# EAGLE design irc_base (1) (EAGLE 9.5.2)
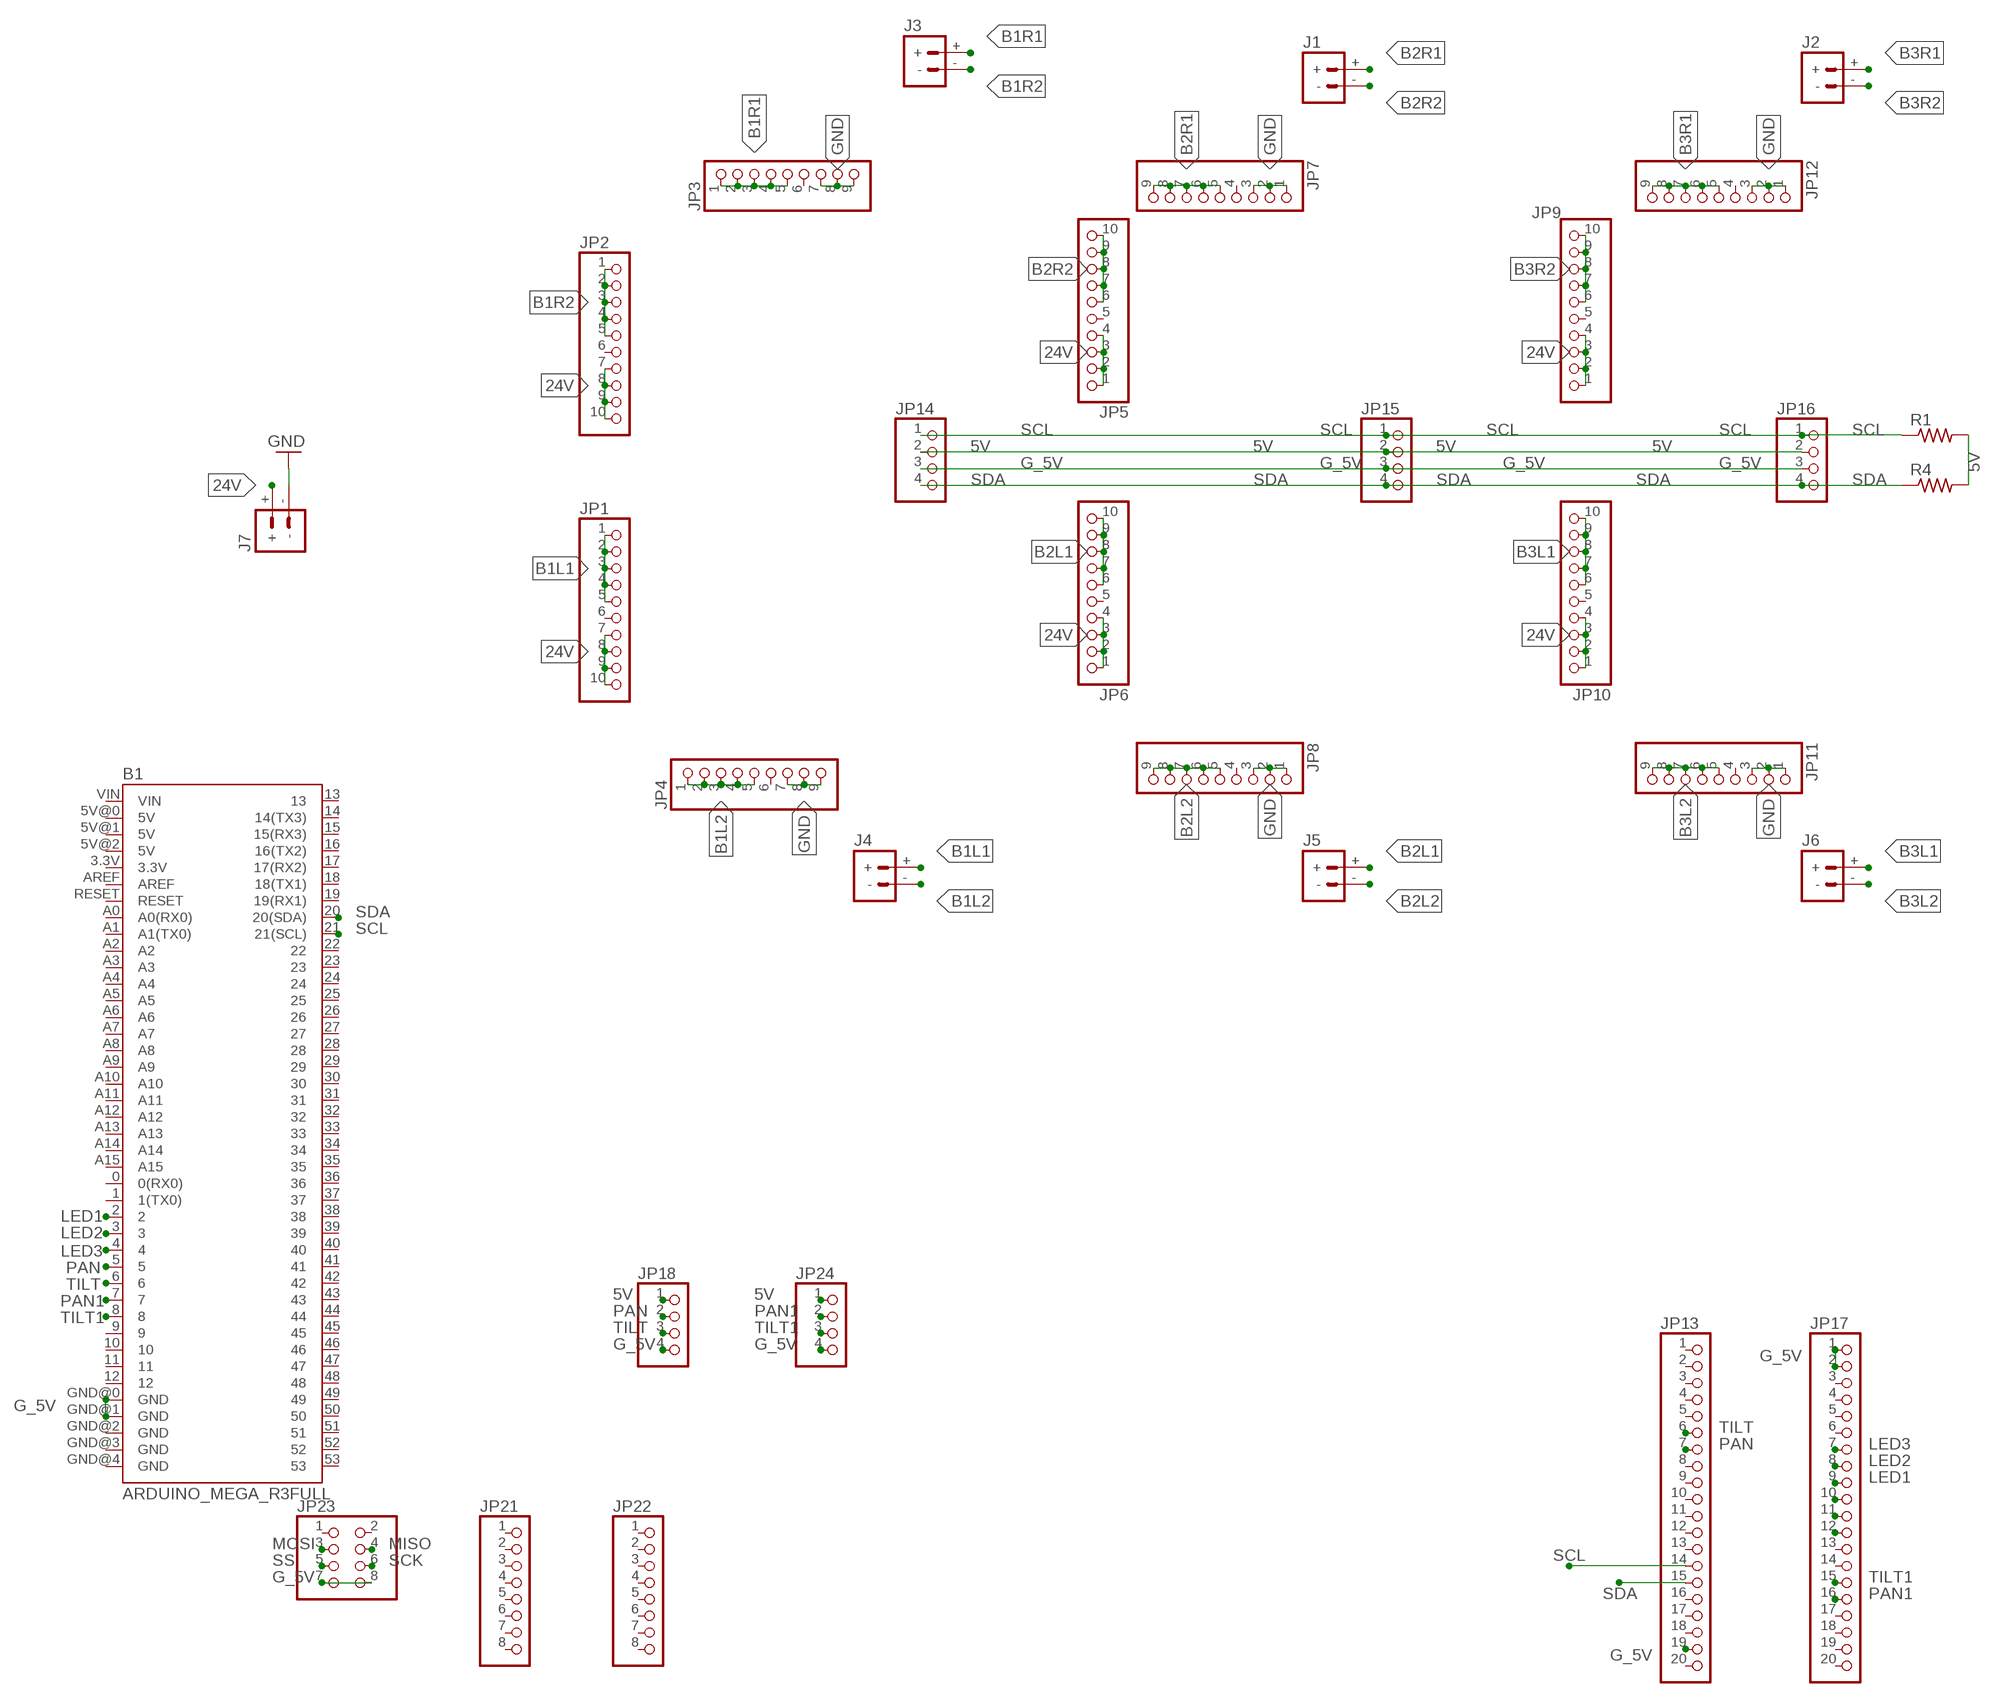
[diagram p0: schematic, sheet 1, part 1 of 2]
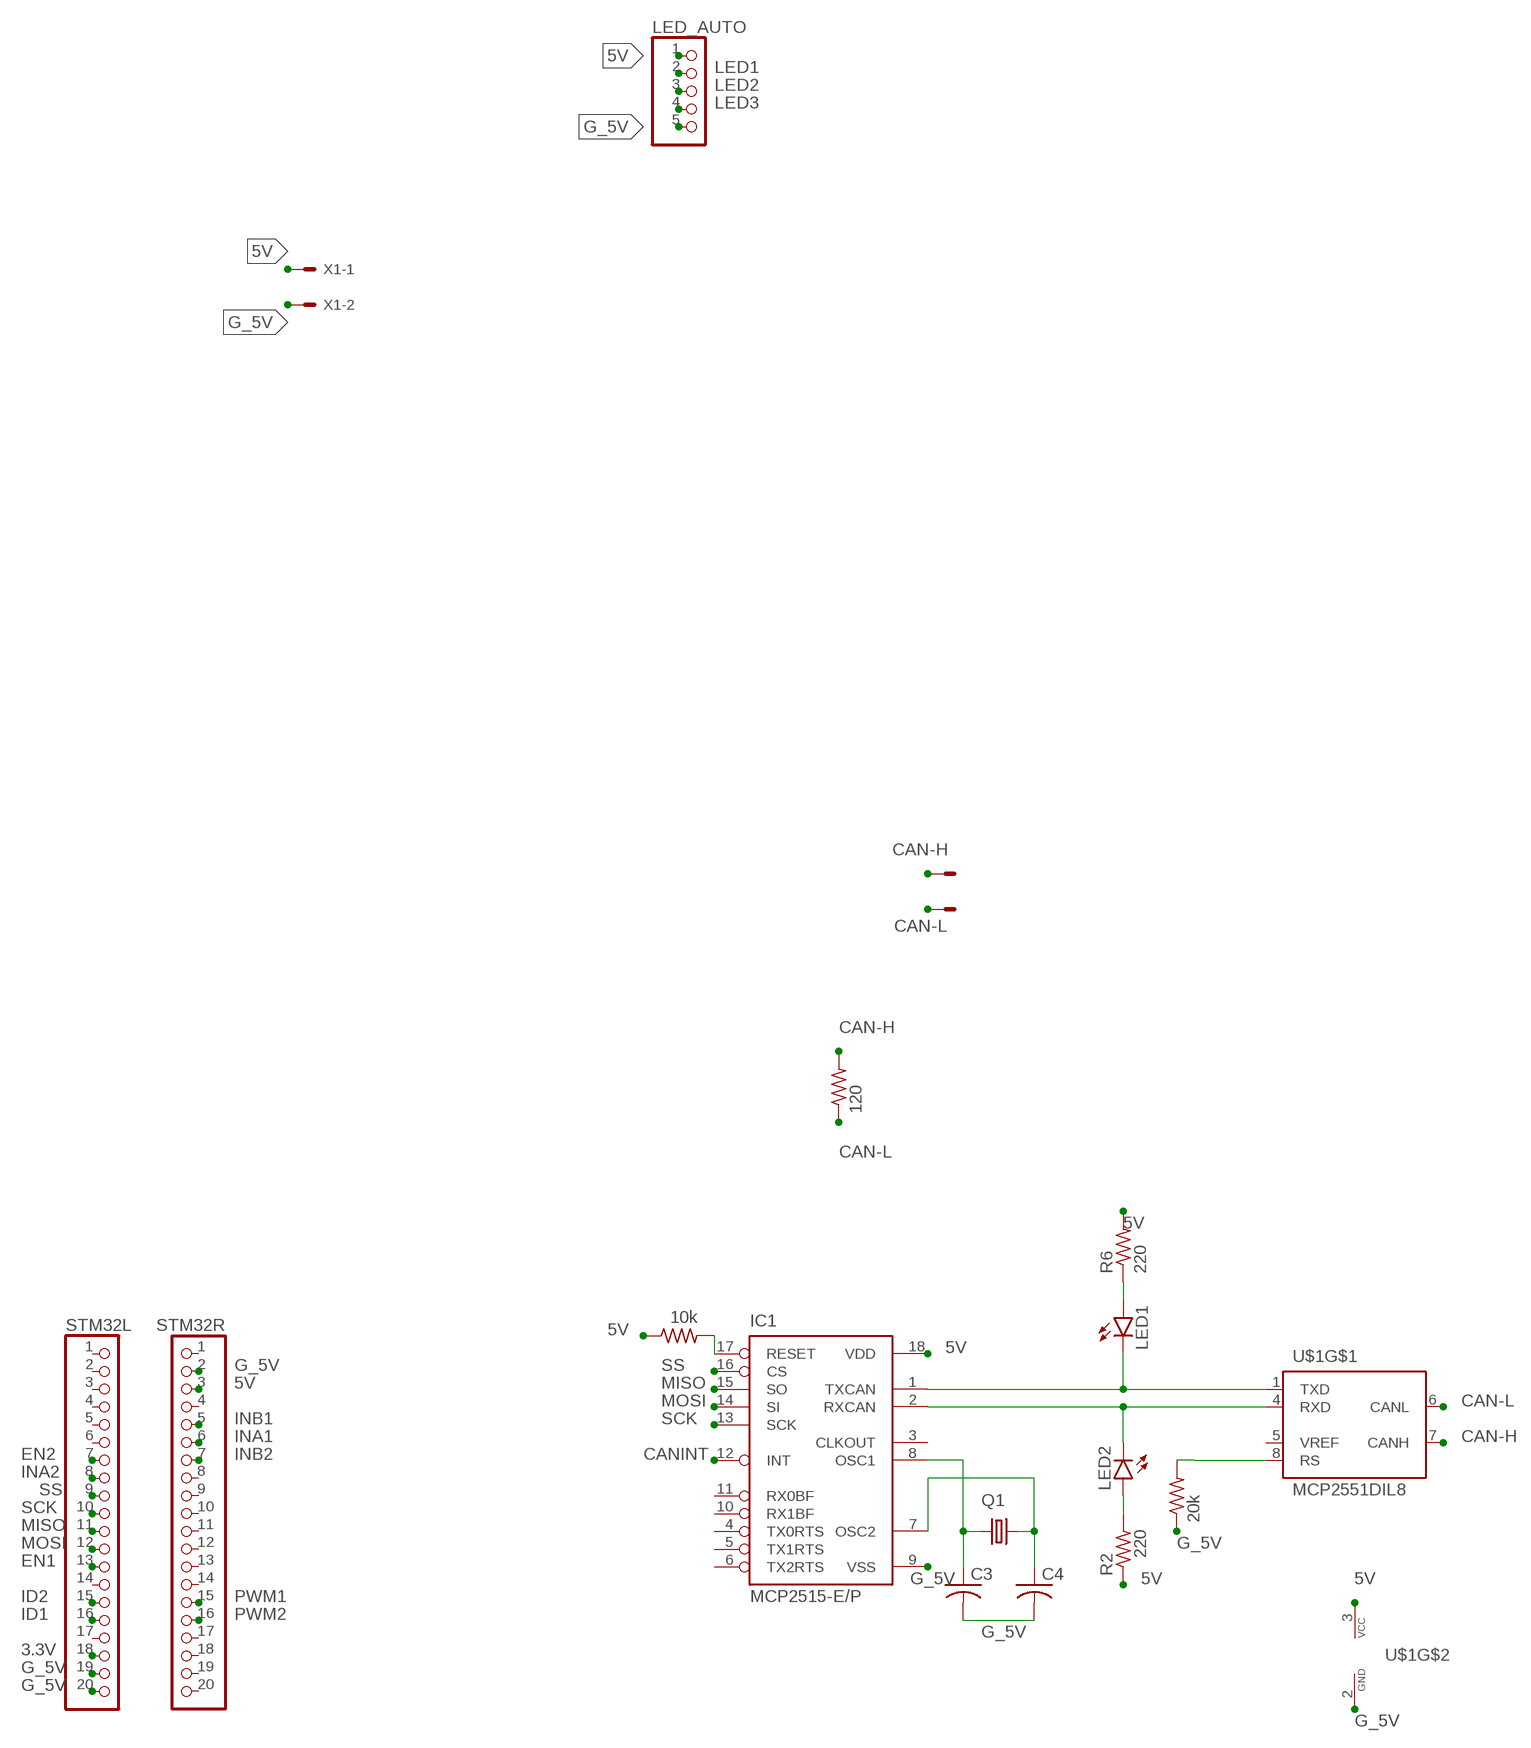
[diagram p1: schematic, sheet 1, part 2 of 2]

## Parts
B1  ARDUINO_MEGA_R3FULL  [ARDUINO_MEGA]
C3  C-US025-024X044  [C025-024X044]
C4  C-US025-024X044  [C025-024X044]
IC1  MCP2515-E/P  [DIL18]
J1  BATTERY_CONN_DEANS  [DEANS]
J2  BATTERY_CONN_DEANS  [DEANS]
J3  BATTERY_CONN_DEANS  [DEANS]
J4  BATTERY_CONN_DEANS  [DEANS]
J5  BATTERY_CONN_DEANS  [DEANS]
J6  BATTERY_CONN_DEANS  [DEANS]
J7  BATTERY_CONN_DEANS  [DEANS]
JP1  PINHD-1X10  [1X10]
JP2  PINHD-1X10  [1X10]
JP3  PINHD-1X9  [1X09]
JP4  PINHD-1X9  [1X09]
JP5  PINHD-1X10  [1X10]
JP6  PINHD-1X10  [1X10]
JP7  PINHD-1X9  [1X09]
JP8  PINHD-1X9  [1X09]
JP9  PINHD-1X10  [1X10]
JP10  PINHD-1X10  [1X10]
JP11  PINHD-1X9  [1X09]
JP12  PINHD-1X9  [1X09]
JP13  PINHD-1X20  [1X20]
JP14  PINHD-1X4  [1X04]
JP15  PINHD-1X4  [1X04]
JP16  PINHD-1X4  [1X04]
JP17  PINHD-1X20  [1X20]
JP18  PINHD-1X4  [1X04]
JP21  PINHD-1X8  [1X08]
JP22  PINHD-1X8  [1X08]
JP23  PINHD-2X4  [2X04]
JP24  PINHD-1X4  [1X04]
LED1  LEDSMT1206  [1206]
LED2  LEDSMT1206  [1206]
LED_AUTO  PINHD-1X5  [1X05]
Q1  CRYSTALHC49U-V  [HC49U-V]
R1  R-US_0207/9  [0207/9]
R2  220  R-US_R0805  [R0805]
R3  120  R-US_0207/9  [0207/9]
R4  R-US_0207/9  [0207/9]
R6  220  R-US_R0805  [R0805]
R39  10k  R-US_0207/10  [0207/10]
R40  20k  R-US_0207/10  [0207/10]
STM32L  PINHD-1X20  [1X20]
STM32R  PINHD-1X20  [1X20]
U$1  MCP2551DIL8  [DIL08]
X1  KK-156-2  [KK-156-2]
X2  KK-156-2  [KK-156-2]

## Nets
3.3V: STM32L.18
5V: IC1.18(VDD) JP14.2 JP15.2 JP16.2 JP18.1 JP24.1 LED_AUTO.1 R1.2 R2.1 R4.2 R6.2 R39.1 STM32R.3 U$1.3(VCC) X1.1
24V: J7.+ JP1.7 JP1.8 JP1.9 JP1.10 JP2.7 JP2.8 JP2.9 JP2.10 JP5.1 JP5.2 JP5.3 JP5.4 JP6.1 JP6.2 JP6.3 JP6.4 JP9.1 JP9.2 JP9.3 JP9.4 JP10.1 JP10.2 JP10.3 JP10.4
B1L1: J4.+ JP1.1 JP1.2 JP1.3 JP1.4 JP1.5
B1L2: J4.- JP4.1 JP4.2 JP4.3 JP4.4 JP4.5
B1R1: J3.+ JP3.1 JP3.2 JP3.3 JP3.4 JP3.5
B1R2: J3.- JP2.1 JP2.2 JP2.3 JP2.4 JP2.5
B2L1: J5.+ JP6.6 JP6.7 JP6.8 JP6.9 JP6.10
B2L2: J5.- JP8.5 JP8.6 JP8.7 JP8.8 JP8.9
B2R1: J1.+ JP7.5 JP7.6 JP7.7 JP7.8 JP7.9
B2R2: J1.- JP5.6 JP5.7 JP5.8 JP5.9 JP5.10
B3L1: J6.+ JP10.6 JP10.7 JP10.8 JP10.9 JP10.10
B3L2: J6.- JP11.5 JP11.6 JP11.7 JP11.8 JP11.9
B3R1: J2.+ JP12.5 JP12.6 JP12.7 JP12.8 JP12.9
B3R2: J2.- JP9.6 JP9.7 JP9.8 JP9.9 JP9.10
CAN-H: R3.2 U$1.7(CANH) X2.1
CAN-L: R3.1 U$1.6(CANL) X2.2
CANINT: IC1.12(INT)
EN1: STM32L.13
EN2: STM32L.7
G_5V: B1.GND@0(GND) B1.GND@1(GND) C3.2 C4.2 IC1.9(VSS) JP13.19 JP14.3 JP15.3 JP16.3 JP17.1 JP17.2 JP18.4 JP23.7 JP23.8 JP24.4 LED_AUTO.5 R40.1 STM32L.19 STM32L.20 STM32R.2 U$1.2(GND) X1.2
GND: J7.- JP3.7 JP3.8 JP3.9 JP4.7 JP4.8 JP4.9 JP7.1 JP7.2 JP7.3 JP8.1 JP8.2 JP8.3 JP11.1 JP11.2 JP11.3 JP12.1 JP12.2 JP12.3
ID1: STM32L.16
ID2: STM32L.15
INA1: STM32R.6
INA2: STM32L.8
INB1: STM32R.5
INB2: STM32R.7
LED1: B1.2 JP17.9 LED_AUTO.2
LED2: B1.3 JP17.8 LED_AUTO.3
LED3: B1.4 JP17.7 LED_AUTO.4
MISO: IC1.15(SO) JP23.4 STM32L.11
MOSI: IC1.14(SI) JP23.3 STM32L.12
N$1: IC1.1(TXCAN) LED1.C U$1.1(TXD)
N$2: R40.2 U$1.8(RS)
N$3: C4.1 IC1.7(OSC2) Q1.2
N$4: C3.1 IC1.8(OSC1) Q1.1
N$8: JP17.10
N$9: IC1.17(RESET) R39.2
N$10: JP17.11
N$11: JP17.12
N$29: LED2.A R2.2
N$37: LED1.A R6.1
N$38: IC1.2(RXCAN) LED2.C U$1.4(RXD)
PAN: B1.5 JP13.7 JP18.2
PAN1: B1.7 JP17.16 JP24.2
PWM1: STM32R.15
PWM2: STM32R.16
SCK: IC1.13(SCK) JP23.6 STM32L.10
SCL: B1.21(21(SCL)) JP13.14 JP14.1 JP15.1 JP16.1 R1.1
SDA: B1.20(20(SDA)) JP13.15 JP14.4 JP15.4 JP16.4 R4.1
SS: IC1.16(CS) JP23.5 STM32L.9
TILT: B1.6 JP13.6 JP18.3
TILT1: B1.8 JP17.15 JP24.3
Unconnected: B1.0(0(RX0)) B1.1(1(TX0)) B1.3.3V B1.5V@0(5V) B1.5V@1(5V) B1.5V@2(5V) B1.9 B1.10 B1.11 B1.12 B1.13 B1.14(14(TX3)) B1.15(15(RX3)) B1.16(16(TX2)) B1.17(17(RX2)) B1.18(18(TX1)) B1.19(19(RX1)) B1.22 B1.23 B1.24 B1.25 B1.26 B1.27 B1.28 B1.29 B1.30 B1.31 B1.32 B1.33 B1.34 B1.35 B1.36 B1.37 B1.38 B1.39 B1.40 B1.41 B1.42 B1.43 B1.44 B1.45 B1.46 B1.47 B1.48 B1.49 B1.50 B1.51 B1.52 B1.53 B1.A0(A0(RX0)) B1.A1(A1(TX0)) B1.A2 B1.A3 B1.A4 B1.A5 B1.A6 B1.A7 B1.A8 B1.A9 B1.A10 B1.A11 B1.A12 B1.A13 B1.A14 B1.A15 B1.AREF B1.GND@2(GND) B1.GND@3(GND) B1.GND@4(GND) B1.RESET B1.VIN IC1.3(CLKOUT) IC1.4(TX0RTS) IC1.5(TX1RTS) IC1.6(TX2RTS) IC1.10(RX1BF) IC1.11(RX0BF) JP1.6 JP2.6 JP3.6 JP4.6 JP5.5 JP6.5 JP7.4 JP8.4 JP9.5 JP10.5 JP11.4 JP12.4 JP13.1 JP13.2 JP13.3 JP13.4 JP13.5 JP13.8 JP13.9 JP13.10 JP13.11 JP13.12 JP13.13 JP13.16 JP13.17 JP13.18 JP13.20 JP17.3 JP17.4 JP17.5 JP17.6 JP17.13 JP17.14 JP17.17 JP17.18 JP17.19 JP17.20 JP21.1 JP21.2 JP21.3 JP21.4 JP21.5 JP21.6 JP21.7 JP21.8 JP22.1 JP22.2 JP22.3 JP22.4 JP22.5 JP22.6 JP22.7 JP22.8 JP23.1 JP23.2 STM32L.1 STM32L.2 STM32L.3 STM32L.4 STM32L.5 STM32L.6 STM32L.14 STM32L.17 STM32R.1 STM32R.4 STM32R.8 STM32R.9 STM32R.10 STM32R.11 STM32R.12 STM32R.13 STM32R.14 STM32R.17 STM32R.18 STM32R.19 STM32R.20 U$1.5(VREF)

## Library data of the parts
B1 = SparkFun-Boards:ARDUINO_MEGA_R3: Arduino Mega R3 ATmega2560 R3 compatible footprint. SparkFun Products: Arduino Mega 2560 R3 <https://www.sparkfun.com/products/11061>
C3 C4 = adafruit:C-US: CAPACITOR, American symbol
IC1 = mcp2515:MCP2515
J1-J7 = SparkFun-Connectors:BATTERY_CONN: Battery Connectors Various footprints for battery connections SparkFun Products: Deans Connector -M/F Pair <https://www.sparkfun.com/products/11864>; SF_ID: PRT-11864
JP1 JP2 JP5 JP6 JP9 JP10 = pinhead:PINHD-1X10: PIN HEADER
JP3 JP4 JP7 JP8 JP11 JP12 = pinhead:PINHD-1X9: PIN HEADER
JP13 JP17 = pinhead:PINHD-1X20: PIN HEADER
JP14-JP16 JP18 JP24 = pinhead:PINHD-1X4: PIN HEADER
JP21 JP22 = pinhead:PINHD-1X8: PIN HEADER
JP23 = adafruit:PINHD-2X4: PIN HEADER
LED1 LED2 = led:LED: LED OSRAM: - CHIPLED LG R971, LG N971, LY N971, LG Q971, LY Q971, LO R971, LY R971 LH N974, LH R974 LS Q976, LO Q976, LY Q976 LO Q996 - Hyper CHIPLED LW Q18S LB Q993, LB Q99A, LB R99A - SideLED LS A670, LO A670, LY A670, LG A670, LP A670 LB A673, LV A673, LT A673, LW A673 LH A674 LY A675 LS A676, LA A676, LO A676, LY A676, LW A676 LS A679, LY A679, LG A679 - Hyper Micro SIDELED® LS Y876, LA Y876, LO Y876, LY Y876 LT Y87S - SmartLED LW L88C, LW L88S LB L89C, LB L89S, LG L890 LS L89K, LO L89K, LY L89K LS L896, LA L896, LO L896, LY L896 - TOPLED LS T670, LO T670, LY T670, LG T670, LP T670 LSG T670, LSP T670, LSY T670, LOP T670, LYG T670 LG T671, LOG T671, LSG T671 LB T673, LV T673, LT T673, LW T673 LH T674 LS T676, LA T676, LO T676, LY T676, LB T676, LH T676, LSB T676, LW T676 LB T67C, LV T67C, LT T67C, LS T67K, LO T67K, LY T67K, LW E67C LS E67B, LA E67B, LO E67B, LY E67B, LB E67C, LV E67C, LT E67C LW T67C LS T679, LY T679, LG T679 LS T770, LO T770, LY T770, LG T770, LP T770 LB T773, LV T773, LT T773, LW T773 LH T774 LS E675, LA E675, LY E675, LS T675 LS T776, LA T776, LO T776, LY T776, LB T776 LHGB T686 LT T68C, LB T68C - Hyper Mini TOPLED® LB M676 - Mini TOPLED Santana® LG M470 LS M47K, LO M47K, LY M47K Source: http://www.osram.convergy.de LUXEON: - LUMILED® LXK2-PW12-R00, LXK2-PW12-S00, LXK2-PW14-U00, LXK2-PW14-V00 LXK2-PM12-R00, LXK2-PM12-S00, LXK2-PM14-U00 LXK2-PE12-Q00, LXK2-PE12-R00, LXK2-PE12-S00, LXK2-PE14-T00, LXK2-PE14-U00 LXK2-PB12-K00, LXK2-PB12-L00, LXK2-PB12-M00, LXK2-PB14-N00, LXK2-PB14-P00, LXK2-PB14-Q00 LXK2-PR12-L00, LXK2-PR12-M00, LXK2-PR14-Q00, LXK2-PR14-R00 LXK2-PD12-Q00, LXK2-PD12-R00, LXK2-PD12-S00 LXK2-PH12-R00, LXK2-PH12-S00 LXK2-PL12-P00, LXK2-PL12-Q00, LXK2-PL12-R00 Source: www.luxeon.com KINGBRIGHT: KA-3528ASYC Source: www.kingbright.com
LED_AUTO = pinhead:PINHD-1X5: PIN HEADER
Q1 = adafruit:CRYSTAL: CRYSTAL; OC_FARNELL: 1666969; OC_NEWARK: unknown
R1 R3 R4 R39 R40 = adafruit:R-US_: RESISTOR, American symbol
R2 R6 = rcl:R-US_: RESISTOR, American symbol; SPICEPREFIX: R
STM32L STM32R = adafruit:PINHD-1X20: PIN HEADER
U$1 = can:MCP2551: CAN Tranceiver Microchip
X1 X2 = con-molex:KK-156-2: KK 156 HEADER Source: http://www.molex.com/pdm_docs/sd/026604100_sd.pdf; MF: MOLEX; OC_FARNELL: unknown; OC_NEWARK: unknown

## Board
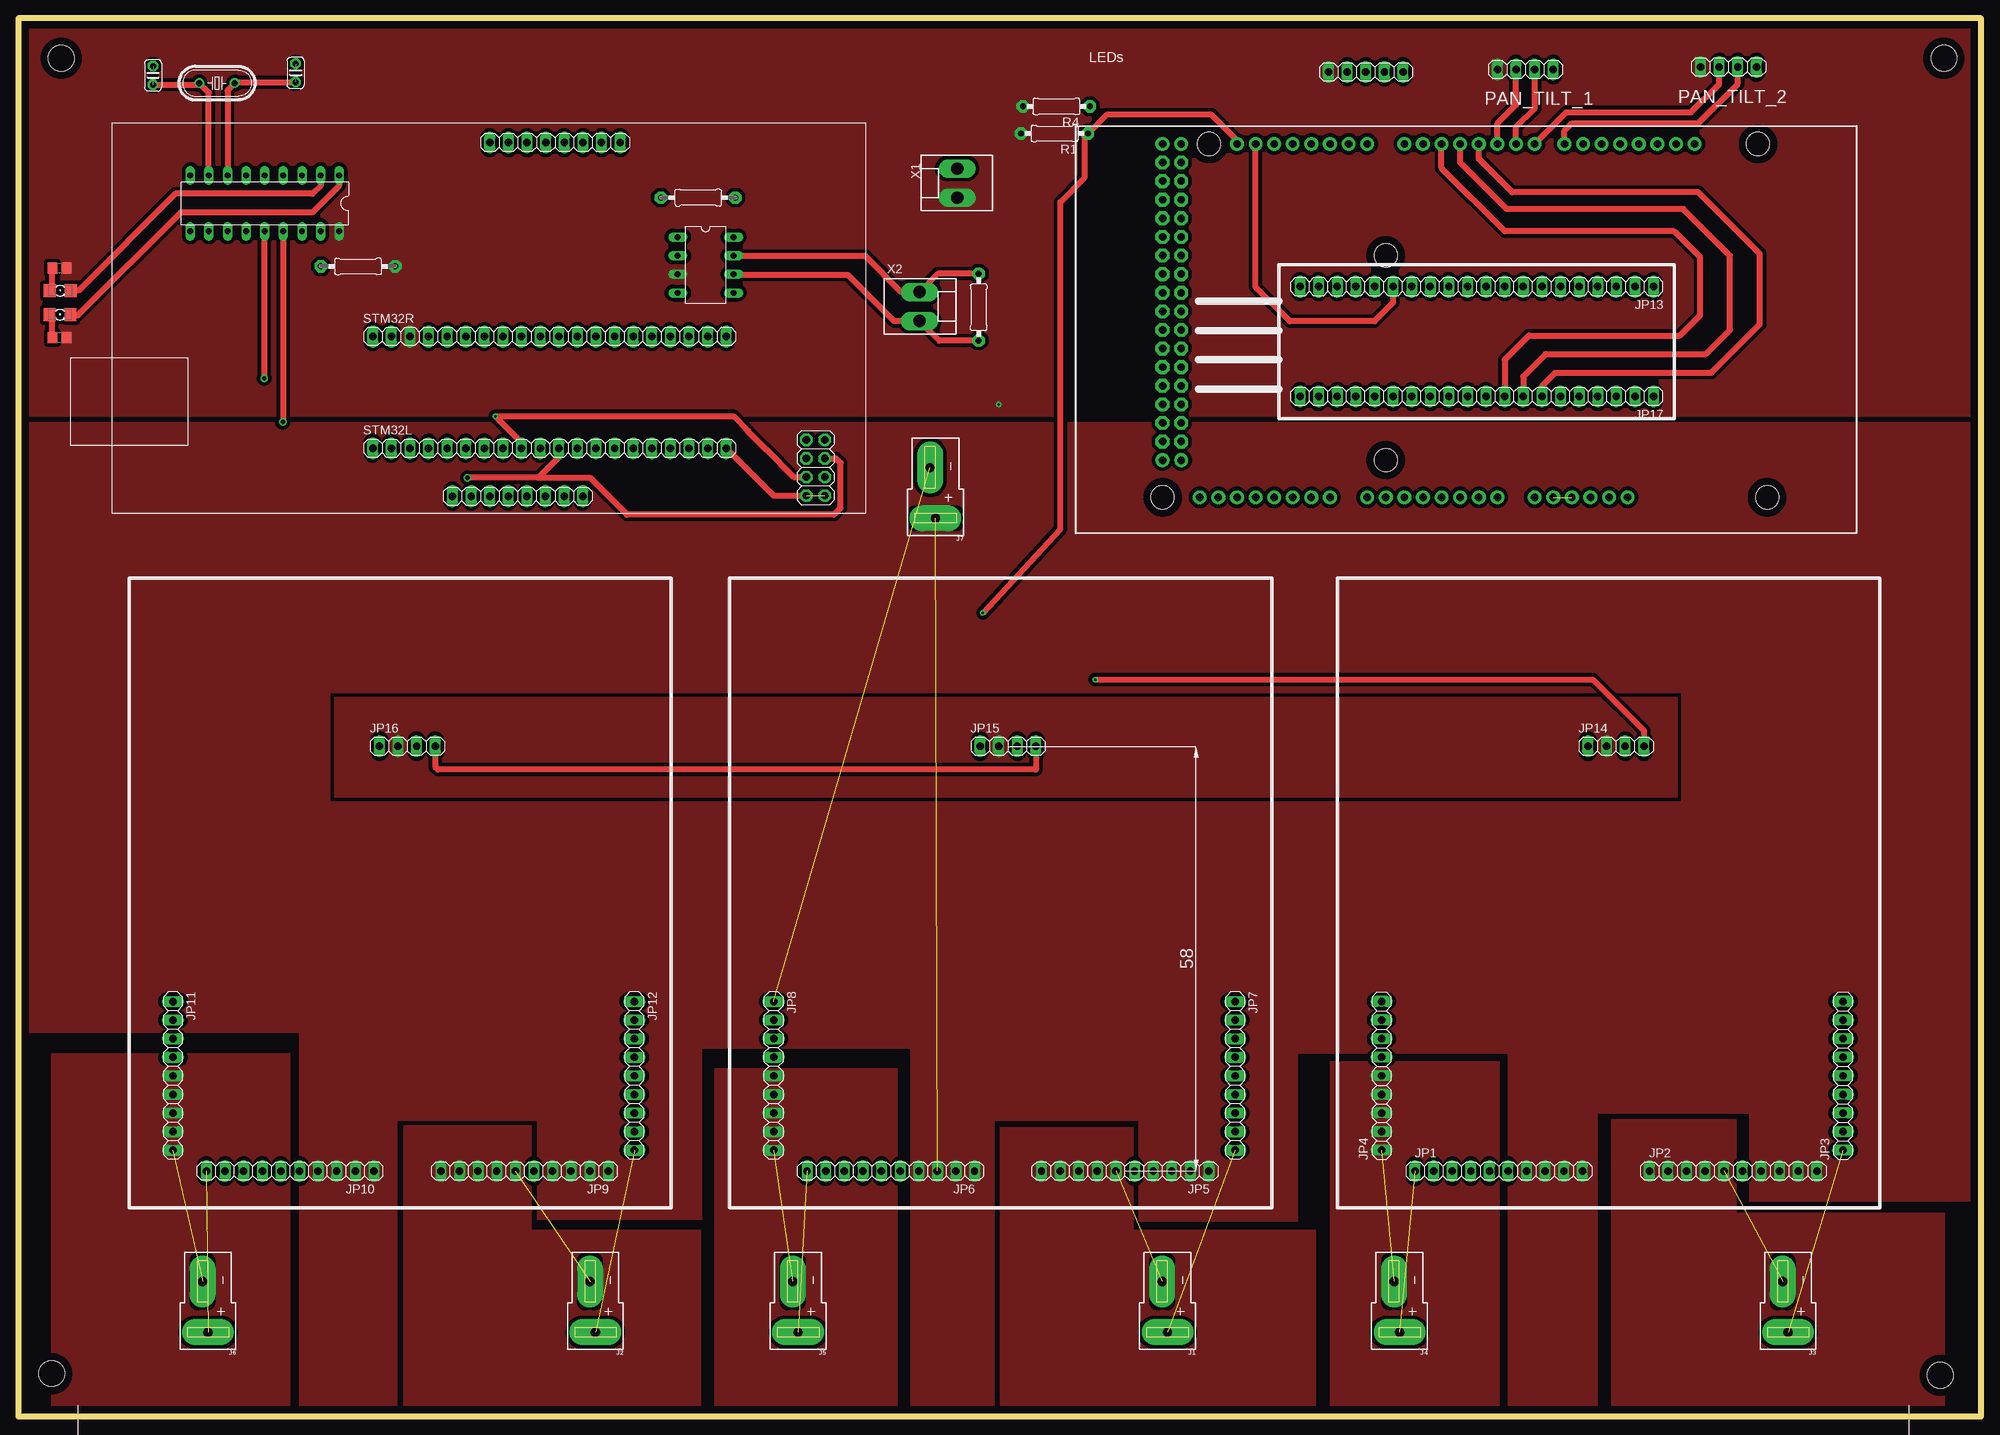
[diagram p2: board, top side]
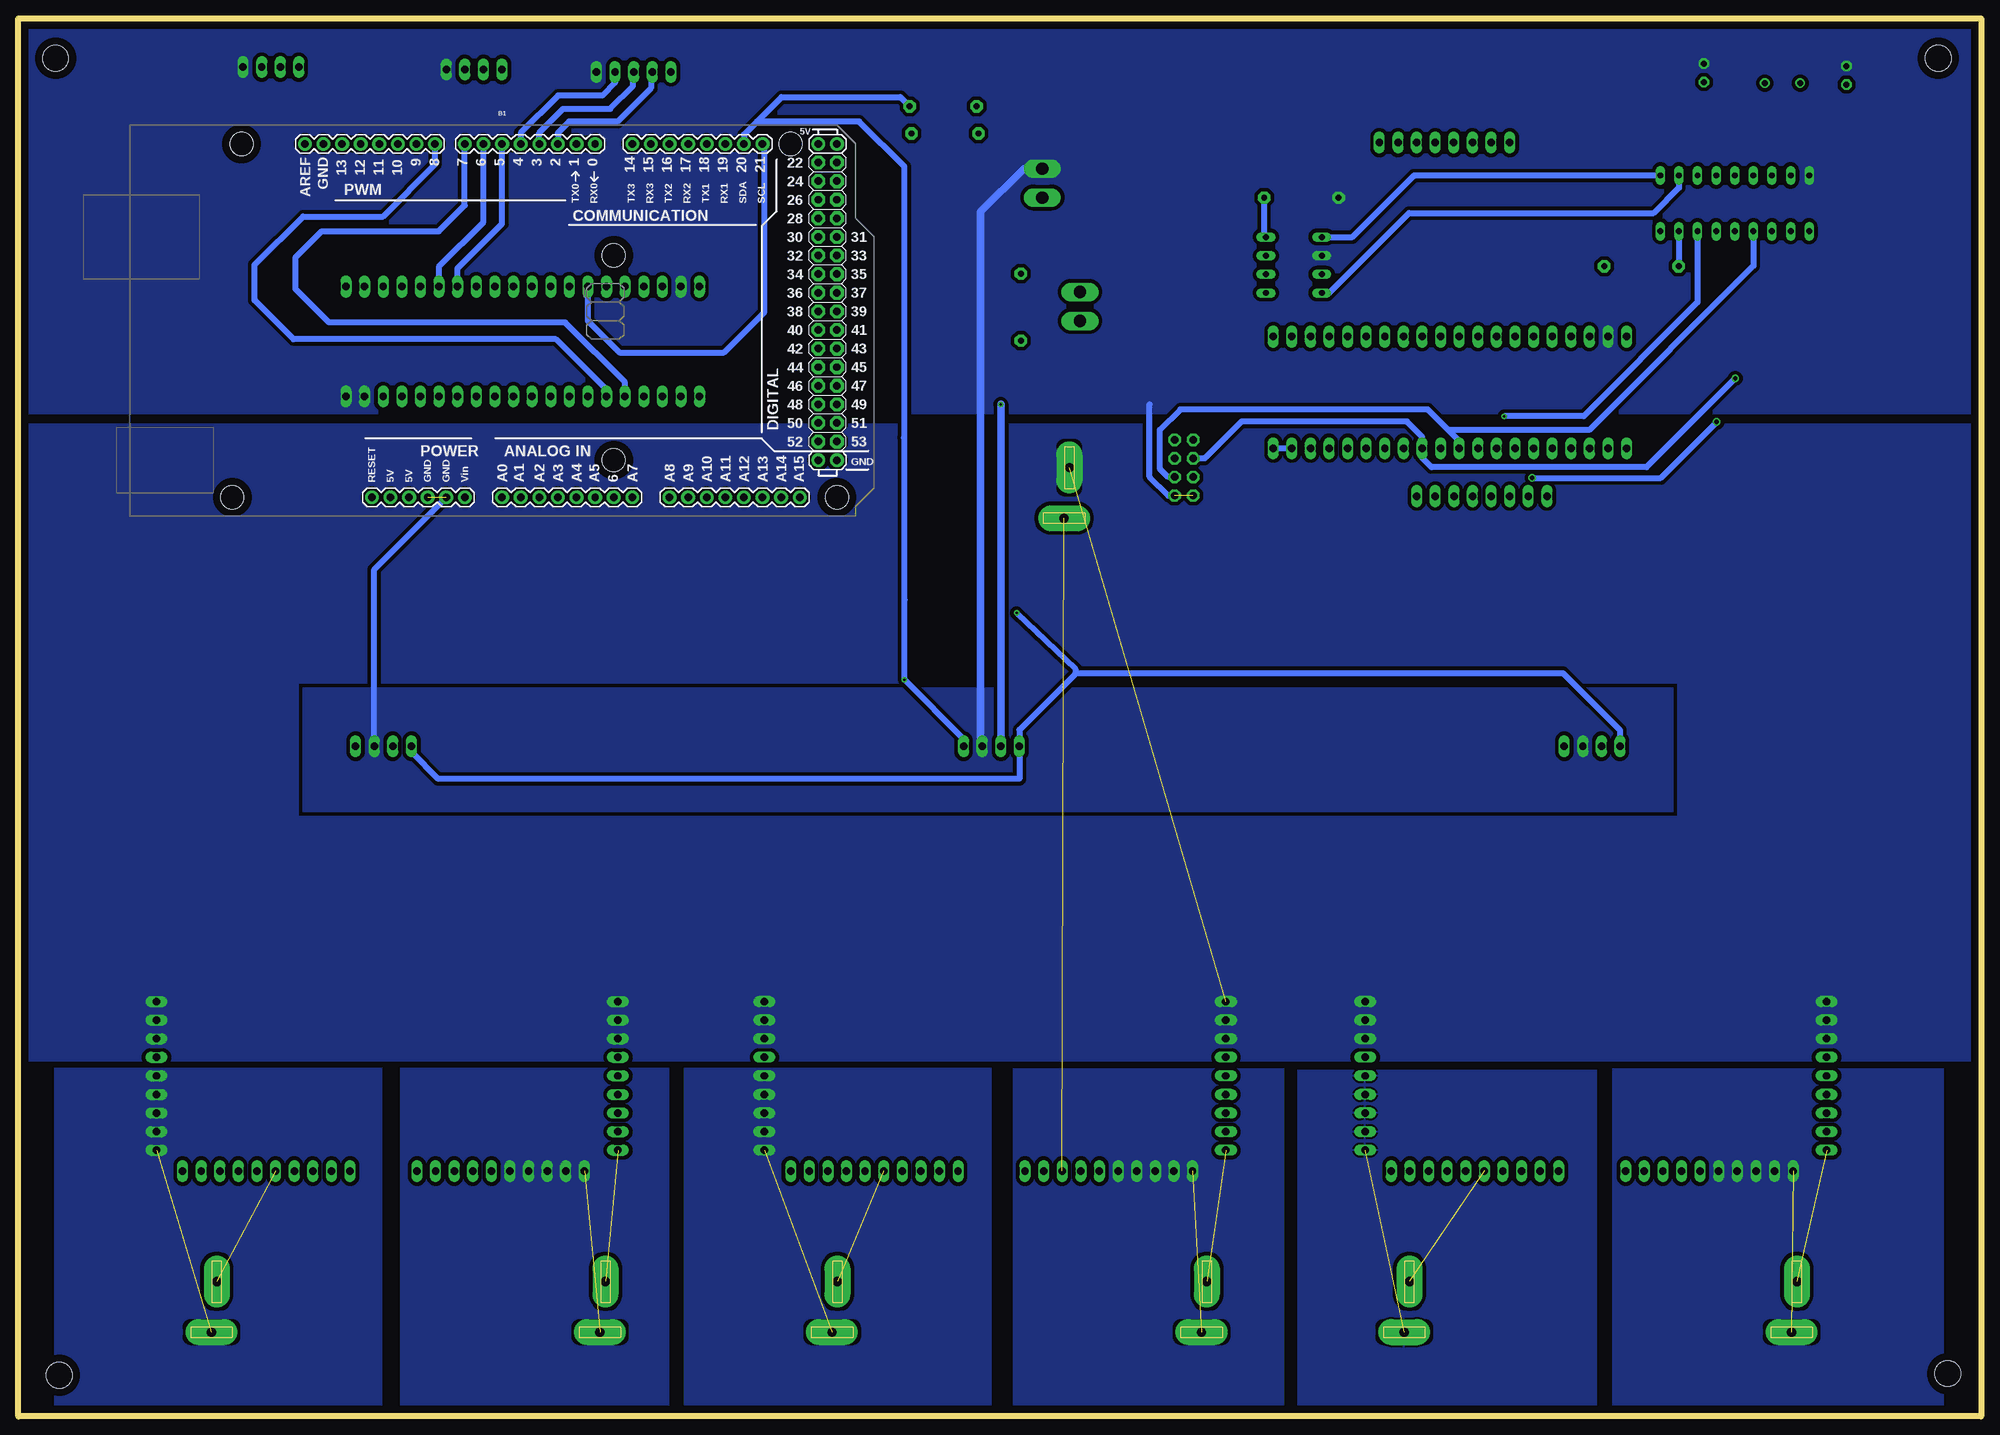
[diagram p3: board, bottom side, seen from below]

Size 267.97 x 190.88 mm. Coordinates in mm from the lower left corner, seen from the top.
Outline: 0,0 267.97,0 267.97,190.88 0,190.88 0,0
Copper layers (1*16): Top 0.035mm / dielectric 1.5mm / Bottom 0.035mm
Design rules "default *": minimum track width 6mil, minimum drill 0.35mm, track to track 20mil, track to pad 20mil, pad to pad 20mil, via to via 20mil, smd to smd 20mil, copper to edge 40mil, drill to drill 6mil, minimum pad ring 10mil, minimum via ring 8mil, stop-mask expansion 4mil, vias tented up to drill 0mil, thermal gap 10mil
Holes 3.56 mm at 5.84,185.42 262.89,185.42 262.38,5.59 4.57,5.84

### Footprints (pad centres in the part's own frame; a part is rotated, then mirrored left to right if it is on the bottom)
ARDUINO_MEGA = drill 1.016 pad 1.88: 0 13.97,24.13; 1 11.43,24.13; 2 8.89,24.13; 3 6.35,24.13; 3.3V -13.97,-24.13; 4 3.81,24.13; 5 1.27,24.13; 5V@0 -11.43,-24.13; 5V@1 44.45,24.13; 5V@2 46.99,24.13; 6 -1.27,24.13; 7 -3.81,24.13; 8 -7.874,24.13; 9 -10.414,24.13; 10 -12.954,24.13; 11 -15.494,24.13; 12 -18.034,24.13; 13 -20.574,24.13; 14 19.05,24.13; 15 21.59,24.13; 16 24.13,24.13; 17 26.67,24.13; 18 29.21,24.13; 19 31.75,24.13; 20 34.29,24.13; 21 36.83,24.13; A0 1.27,-24.13; A1 3.81,-24.13; A2 6.35,-24.13; A3 8.89,-24.13; A4 11.43,-24.13; A5 13.97,-24.13; A6 16.51,-24.13; A7 19.05,-24.13; A8 24.13,-24.13; A9 26.67,-24.13; A10 29.21,-24.13; A11 31.75,-24.13; A12 34.29,-24.13; A13 36.83,-24.13; A14 39.37,-24.13; A15 41.91,-24.13; AREF -25.654,24.13; GND@0 -8.89,-24.13; GND@1 -6.35,-24.13; GND@2 44.45,-19.05; GND@3 46.99,-19.05; GND@4 -23.114,24.13; RESET -16.51,-24.13; VIN -3.81,-24.13 | drill 1.016 pad 1.88 octagon: 22 44.45,21.59; 23 46.99,21.59; 24 44.45,19.05; 25 46.99,19.05; 26 44.45,16.51; 27 46.99,16.51; 28 44.45,13.97; 29 46.99,13.97; 30 44.45,11.43; 31 46.99,11.43; 32 44.45,8.89; 33 46.99,8.89; 34 44.45,6.35; 35 46.99,6.35; 36 44.45,3.81; 37 46.99,3.81; 38 44.45,1.27; 39 46.99,1.27; 40 44.45,-1.27; 41 46.99,-1.27; 42 44.45,-3.81; 43 46.99,-3.81; 44 44.45,-6.35; 45 46.99,-6.35; 46 44.45,-8.89; 47 46.99,-8.89; 48 44.45,-11.43; 49 46.99,-11.43; 50 44.45,-13.97; 51 46.99,-13.97; 52 44.45,-16.51; 53 46.99,-16.51 | hole 3.2: -34.29,24.13; -35.56,-24.13; 16.51,8.89; 16.51,-19.05; 40.64,24.13; 46.99,-24.13
C025-024X044 = drill 0.813 pad 1.422 octagon: 1 -1.27,0; 2 1.27,0
DIL18 = drill 0.813 long: 1 -10.16,-3.81; 2 -7.62,-3.81; 3 -5.08,-3.81; 4 -2.54,-3.81; 5 0,-3.81; 6 2.54,-3.81; 7 5.08,-3.81; 8 7.62,-3.81; 9 10.16,-3.81; 10 10.16,3.81; 11 7.62,3.81; 12 5.08,3.81; 13 2.54,3.81; 14 0,3.81; 15 -2.54,3.81; 16 -5.08,3.81; 17 -7.62,3.81; 18 -10.16,3.81
DEANS = drill 1.27 pad 3.556 long: + 0,0; - 0.737,-6.921
1X10 = drill 1.016 long: 1 -11.43,0; 2 -8.89,0; 3 -6.35,0; 4 -3.81,0; 5 -1.27,0; 6 1.27,0; 7 3.81,0; 8 6.35,0; 9 8.89,0; 10 11.43,0
1X09 = drill 1.016 long: 1 -10.16,0; 2 -7.62,0; 3 -5.08,0; 4 -2.54,0; 5 0,0; 6 2.54,0; 7 5.08,0; 8 7.62,0; 9 10.16,0
1X20 = drill 1.016 long: 1 -24.13,0; 2 -21.59,0; 3 -19.05,0; 4 -16.51,0; 5 -13.97,0; 6 -11.43,0; 7 -8.89,0; 8 -6.35,0; 9 -3.81,0; 10 -1.27,0; 11 1.27,0; 12 3.81,0; 13 6.35,0; 14 8.89,0; 15 11.43,0; 16 13.97,0; 17 16.51,0; 18 19.05,0; 19 21.59,0; 20 24.13,0
1X04 = drill 1.016 long: 1 -3.81,0; 2 -1.27,0; 3 1.27,0; 4 3.81,0
1X08 = drill 1.016 long: 1 -8.89,0; 2 -6.35,0; 3 -3.81,0; 4 -1.27,0; 5 1.27,0; 6 3.81,0; 7 6.35,0; 8 8.89,0
2X04 = drill 1.016 pad 1.676 octagon: 1 -3.81,-1.27; 2 -3.81,1.27; 3 -1.27,-1.27; 4 -1.27,1.27; 5 1.27,-1.27; 6 1.27,1.27; 7 3.81,-1.27; 8 3.81,1.27
1206 = smd 1.6 x 1.803: A -1.422,0; C 1.422,0
1X05 = drill 1.016 long: 1 -5.08,0; 2 -2.54,0; 3 0,0; 4 2.54,0; 5 5.08,0
HC49U-V = drill 0.813: 1 -2.413,0; 2 2.413,0
0207/9 = drill 0.813 pad 1.676 octagon: 1 -4.572,0; 2 4.572,0
R0805 = smd 1.3 x 1.5: 1 -0.95,0; 2 0.95,0
0207/10 = drill 0.813 pad 1.676 octagon: 1 -5.08,0; 2 5.08,0
DIL08 = drill 0.813 long: 1 -3.81,-3.81; 2 -1.27,-3.81; 3 1.27,-3.81; 4 3.81,-3.81; 5 3.81,3.81; 6 1.27,3.81; 7 -1.27,3.81; 8 -3.81,3.81
KK-156-2 = drill 1.7 pad 2.184 long: 1 -1.98,0; 2 1.98,0

### Placement (x,y rotation side)
B1  203.2,149.61 0 bottom
C3  18.4,183.09 90 top
C4  37.86,183.43 90 top
IC1  33.64,165.61 180 top
J1  156.89,11.49 180 top
J2  78.78,11.49 180 top
J3  241.61,11.49 180 top
J4  188.56,11.49 180 top
J5  106.45,11.49 180 top
J6  25.89,11.49 180 top
J7  125.21,122.62 180 top
JP1  202.11,33.49 0 top
JP2  234.11,33.49 0 top
JP3  249.11,46.49 90 top
JP4  186.11,46.49 90 top
JP5  151.11,33.49 180 top
JP6  119.11,33.49 180 top
JP7  166.11,46.49 270 top
JP8  103.11,46.49 270 top
JP9  69.11,33.49 180 top
JP10  37.11,33.49 180 top
JP11  21.11,46.49 270 top
JP12  84.11,46.49 270 top
JP13  199.11,154.25 180 top
JP14  218.11,91.49 0 top
JP15  135.11,91.49 0 top
JP16  53.11,91.49 0 top
JP17  199.11,139.25 180 top
JP18  205.74,183.9 0 top
JP21  73.27,173.91 0 top
JP22  68.17,125.64 0 top
JP23  108.85,129.52 270 top
JP24  233.47,184.22 0 top
LED1  5.7,150.43 0 top
LED2  5.72,153.7 0 top
LED_AUTO  183.96,183.56 0 top
Q1  27.12,182.04 0 top
R1  141.46,175.16 180 top
R2  5.65,156.74 180 top
R3  131.1,151.44 90 top
R4  141.71,178.86 180 top
R6  5.6,147.3 0 top
R39  46.39,157.01 180 top
R40  92.81,166.39 0 top
STM32L  72.52,132.19 0 top
STM32R  72.52,147.43 0 top
U$1  93.84,157.2 270 top
X1  128.17,168.37 90 top
X2  123.03,151.54 270 top

### Tracks (layer width: path | path; a pad name or v marks a point on that pad's centre or on a via)
5V  (via drill 0.35)
  Top 0.813: 6.56,147.32 R6.2
  Bottom 1.016: v133.84,138.18 JP15.2
  pour Top (no thermals): 43.11,98.16 43.11,84.54 226.49,84.54 226.49,98.16
  pour Top (no thermals): -7.62,212.85 -7.62,136.91 278.35,136.91 278.35,212.85
24V  (1 unrouted)
  pour Top (rank 2, no thermals): -12.98,135.66 -12.98,52.42 38.31,52.42 38.31,-6.3 51.73,-6.3 51.73,40.42 70.84,40.42 70.84,26.89 93.36,26.89 93.36,50.29 121.77,50.29 121.77,-3.2 133.29,-3.2 133.29,40.42 152.89,40.42 152.89,26.7 174.69,26.7 174.69,49.64 203.32,49.64 203.32,-4.57 215.58,-4.57 215.58,41.41 236.33,41.41 236.33,29.43 316.03,29.43 316.03,135.66
B1L1  (1 unrouted)
  pour Bottom (no thermals): 215.86,47.49 215.86,-6.51 179.11,-6.51 179.11,47.49
B1L2  (1 unrouted)
  pour Top (no thermals): 179.11,-3.42 179.11,48.49 202.11,48.49 202.11,-3.42
B1R1  (1 unrouted)
  pour Bottom (no thermals): 218.33,47.49 263.03,47.49 263.03,-6.51 218.33,-6.51
B1R2  (1 unrouted)
  pour Top (no thermals): 217.48,-4.66 263,-4.66 263,27.74 234.57,27.74 234.57,40.49 217.48,40.49
B2L1  (1 unrouted)
  pour Bottom (no thermals): 95.28,47.49 95.28,-9.51 132.11,-9.51 132.11,47.49
B2L2  (1 unrouted)
  pour Top (no thermals): 95.11,47.49 119.97,47.49 119.97,-5.59 95.11,-5.59
B2R1  (1 unrouted)
  pour Bottom (no thermals): 135.08,47.49 177.11,47.49 177.11,-6.51 135.08,-6.51
B2R2  (1 unrouted)
  pour Top (no thermals): 134.11,39.49 152.14,39.49 152.14,25.49 177.11,25.49 177.11,-9.41 134.11,-9.41
B3L1  (1 unrouted)
  pour Bottom (no thermals): 5.19,47.49 5.19,-0.51 50.27,-0.51 50.27,47.49
B3L2  (1 unrouted)
  pour Top (no thermals): 4.52,49.49 4.52,-5.51 37.11,-5.51 37.11,49.49
B3R1  (1 unrouted)
  pour Bottom: 52.58,-1.27 93.22,-1.27 93.22,47.24 52.58,47.24
B3R2  (1 unrouted)
  pour Top (no thermals): 52.66,-6.59 52.66,39.72 70,39.72 70,25.49 93.11,25.49 93.11,-6.59
CAN-H
  Top 0.813: U$1.7 97.74,158.37 115.67,158.37 120.52,153.52 X2.1 125.52,156.01 R3.2
CAN-L
  Top 0.813: U$1.6 98.65,155.93 98.72,155.86 113.23,155.86 119.52,149.56 X2.2 125.73,146.87 R3.1
G_5V  (2 unrouted)
  Top 0.813: STM32L.20 103.12,125.71 JP23.7
  Bottom 0.813: 136.59,110.59 136.63,110.54 | STM32L.20 STM32L.19 | JP14.3 219.38,115.65 B1.GND@1 | JP23.8 110.98,125.71 113.54,128.27 113.54,138.18
  Bottom 1.016: 136.63,110.54 136.63,91.74 JP15.3 | 136.59,110.59 136.59,164.45 130.69,170.35 X1.2
  pour Bottom (no thermals): 229.11,99.49 42.11,99.49 42.11,82.49 229.11,82.49
  pour Bottom (no thermals): -6.86,199.14 -6.86,137.16 272.54,137.16 272.54,199.14
GND  (1 unrouted)
  pour Bottom (rank 2, no thermals): -17.89,48.49 302.11,48.49 302.11,135.55 -17.89,135.55
LED1
  Top 0.813: JP17.9 202.92,144.25 206.25,147.57 226.82,147.57 229.62,150.37 229.62,158.24 226.06,161.8 202.95,161.8 194.31,170.43 B1.2
  Bottom 0.813: LED_AUTO.2 181.61,183.37 181.61,181.36 186.18,176.78 192.79,176.78 194.31,175.26 B1.2
LED2
  Top 0.813: JP17.8 205.46,141.96 208.53,145.03 230.38,145.03 233.68,148.34 233.68,158.5 227.33,164.85 203.2,164.85 196.85,171.2 B1.3
  Bottom 0.813: B1.3 196.85,175.26 193.6,178.51 187.16,178.51 184.06,181.61 184.06,183.46 LED_AUTO.3
LED3
  Top 0.813: JP17.7 208,140.69 209.8,142.49 231.14,142.49 237.74,149.1 237.74,158.75 229.36,167.13 203.96,167.13 199.39,171.7 B1.4
  Bottom 0.813: LED_AUTO.4 186.5,182.06 188.21,180.34 194.31,180.34 199.39,175.26 B1.4
MISO  (via drill 0.6)
  Top 0.813: IC1.15 36.18,135.84 v36.11,135.77 | 71.02,128.14 v61.3,128.14 | STM32L.11 73.79,130.91 71.02,128.14 | JP23.4 111.62,130.79 112.25,130.16 112.25,124.03 111.34,123.12 83.08,123.12 78.05,128.14 71.02,128.14
  Bottom 0.813: v61.3,128.14 61.27,128.12 43.77,128.12 v36.11,135.77
MOSI  (via drill 0.6)
  Top 0.813: v33.57,141.72 v33.58,141.73 33.58,161.74 IC1.14
  Bottom 0.813: v33.56,141.71 v33.57,141.72 45.69,129.61 75.03,129.61 76.33,130.9 STM32L.12 76.33,133.75 78.4,135.82 100.99,135.82 106.02,130.79 JP23.3
N$1
  Top 0.813: IC1.1 43.8,168.05 40.1,164.35 22.14,164.35 8.13,150.34 7.21,150.34 LED1.C
  Bottom 0.813: U$1.1 85.86,161.01 77.44,169.42 IC1.1
N$2
  Bottom 0.813: R40.2 97.89,161.25 U$1.8
N$3
  Top 0.813: IC1.7 28.56,181.06 Q1.2 29.66,182.16 C4.1
  Bottom 0.813: C4.1 37.87,182.14
N$4
  Top 0.813: C3.1 24.49,181.82 Q1.1 26.02,180.73 IC1.8
N$9
  Bottom 0.813: IC1.17 41.26,157.06 R39.2
N$29
  Top 0.813: R2.2 4.63,156.74 4.57,156.68 4.57,153.51 4.49,153.51 LED2.A
N$37
  Top 0.813: LED1.A 4.57,150.13 4.57,147.3 R6.1
N$38
  Top 0.813: IC1.2 41.26,168.02 40.15,166.91 21.45,166.91 8.24,153.7 LED2.C
  Bottom 0.813: U$1.4 89.03,153.39 78.12,164.3 44.71,164.3 41.26,167.75 IC1.2
PAN
  Top 0.813: B1.5 201.93,176.53 204.47,179.07 JP18.2
  Bottom 0.813: JP13.7 208,156.74 201.93,162.81 B1.5
PAN1
  Top 0.813: B1.7 211.33,178.05 228.35,178.05 232.2,181.91 JP24.2
  Bottom 0.813: JP17.16 185.14,141.2 193.29,149.35 225.55,149.35 230.12,153.92 230.12,158.24 226.57,161.8 210.57,161.8 207.01,165.35 B1.7
SCK
  Bottom 0.5: 31.1,157.09 31.38,156.81
  Bottom 0.813: 72.77,134.68 53.51,134.68 31.38,156.81 31.21,156.98 | 72.77,134.68 75.57,137.48 109.35,137.48 112.17,134.66 112.17,129.42 111,128.25 JP23.6 | 72.77,134.68 71.25,133.16 STM32L.10 | IC1.13 31.1,157.09
SCL  (via drill 0.35)
  Top 0.813: v131.69,109.69 142.25,121.17 142.25,165.79 145.54,169.09 145.54,174.67 R1.1 148.57,177.7 162.92,177.7 166.37,174.24 B1.21
  Bottom 0.508: 190.22,153.49 190.22,153.25
  Bottom 0.813: 190.22,153.49 JP13.14 190.22,149.6 185.89,145.27 171.64,145.27 166.11,150.79 166.11,173.48 B1.21 | v131.69,109.69 123.66,102.06 123.66,101.48 | 123.66,101.48 123.66,101.39 131.3,93.74 JP15.1 131.3,87.03 210.65,87.03 214.3,90.68 JP14.1 | 123.66,101.48 57.1,101.48 49.3,93.68 JP16.1
SDA  (via drill 0.35)
  Top 0.813: JP13.15 187.68,152.06 185.14,149.52 173.59,149.52 168.91,154.2 B1.20 | v147.01,100.58 214.95,100.58 221.92,93.62 JP14.4 | JP15.4 138.92,88.3 57.3,88.3 56.92,88.68 JP16.4
  Bottom 0.813: 147.01,111.49 146.99,111.52 | 147.01,111.49 v147.01,100.58 138.92,92.49 JP15.4 | 147.01,111.49 147.01,133.55 | 147.01,133.55 147.07,133.6 | 147.01,133.55 147.01,170.64 153.16,176.78 167.13,176.78 | 167.13,176.78 168.91,175.01 B1.20 | R4.1 147.55,180.13 163.79,180.13 167.13,176.78
SS  (via drill 0.35)
  Top 0.813: JP23.5 105.86,128.25 102.15,131.96 102.15,131.95 99.55,134.55 99.64,134.55 97.64,136.55 v65.13,136.55 68.71,132.97 STM32L.9
  Bottom 0.813: IC1.16 38.72,152.09 54.26,136.55 v65.13,136.55
TILT
  Top 0.813: B1.6 204.47,176.02 207.01,178.56 JP18.3
  Bottom 0.813: JP13.6 210.54,156.95 210.57,156.97 204.47,163.07 B1.6
TILT1
  Top 0.813: B1.8 211.07,175.51 212.09,176.53 229.36,176.53 234.74,181.91 JP24.3
  Bottom 0.813: JP17.15 187.68,140.18 194.56,147.07 230.38,147.07 235.71,152.4 235.71,157.23 229.11,163.83 218.19,163.83 211.07,170.94 B1.8

### Text on the board
tPlace: LEDs | PAN_TILT_1 | PAN_TILT_2